# EAGLE design MySXSenors-VM02-002 (EAGLE 7.7.0)
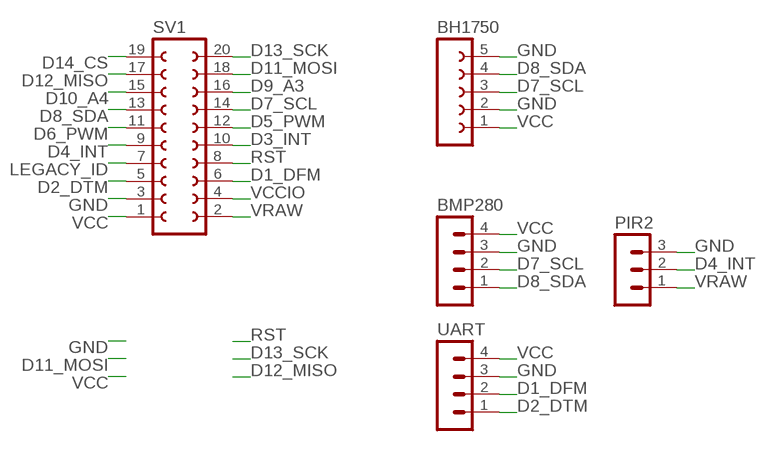
[diagram p0: schematic, sheet 1]

## Parts
BH1750  FE05-1  [FE05-1]
BMP280  MA04-1  [MA04-1]
PIR2  MA03-1  [MA03-1]
SV1  FE10-2  [FE10-2]
UART  MA04-1  [MA04-1]

## Nets
D1_DFM: SV1.6 UART.2
D2_DTM: SV1.5 UART.1
D3_INT: SV1.10
D4_INT: PIR2.2 SV1.9
D5_PWM: SV1.12
D6_PWM: SV1.11
D7_SCL: BH1750.3 BMP280.2 SV1.14
D8_SDA: BH1750.4 BMP280.1 SV1.13
D9_A3: SV1.16
D10_A4: SV1.15
D11_MOSI: SV1.18
D12_MISO: SV1.17
D13_SCK: SV1.20
D14_CS: SV1.19
GND [power]: BH1750.2 BH1750.5 BMP280.3 PIR2.3 SV1.3 UART.3
LEGACY_ID: SV1.7
RST: SV1.8
VCC [power]: BH1750.1 BMP280.4 SV1.1 UART.4
VCCIO [power]: SV1.4
VRAW [power]: PIR2.1 SV1.2

## Library data of the parts
BH1750 = con-lsta:FE05-1: FEMALE HEADER; OC_FARNELL: unknown; OC_NEWARK: unknown
BMP280 UART = con-lstb:MA04-1: PIN HEADER; OC_FARNELL: unknown; OC_NEWARK: unknown
PIR2 = con-lstb:MA03-1: PIN HEADER; OC_FARNELL: unknown; OC_NEWARK: unknown
SV1 = my-con-lsta:FE10-2: FEMALE HEADER; OC_FARNELL: unknown; OC_NEWARK: unknown

## Net classes
0 default: width 0.203 mm
1 power: width 0.508 mm

## Board
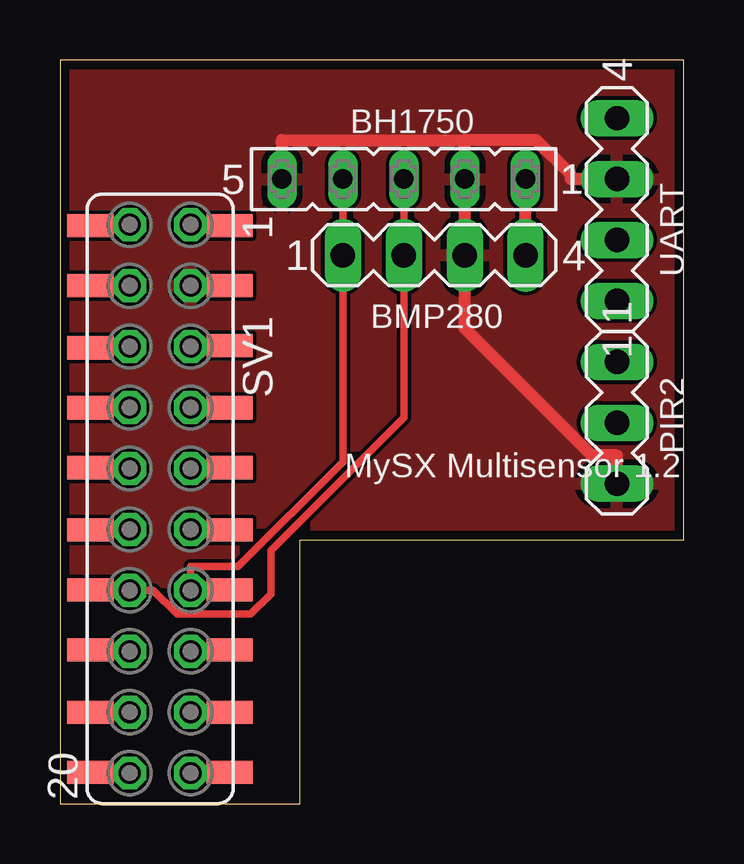
[diagram p1: board, top side]
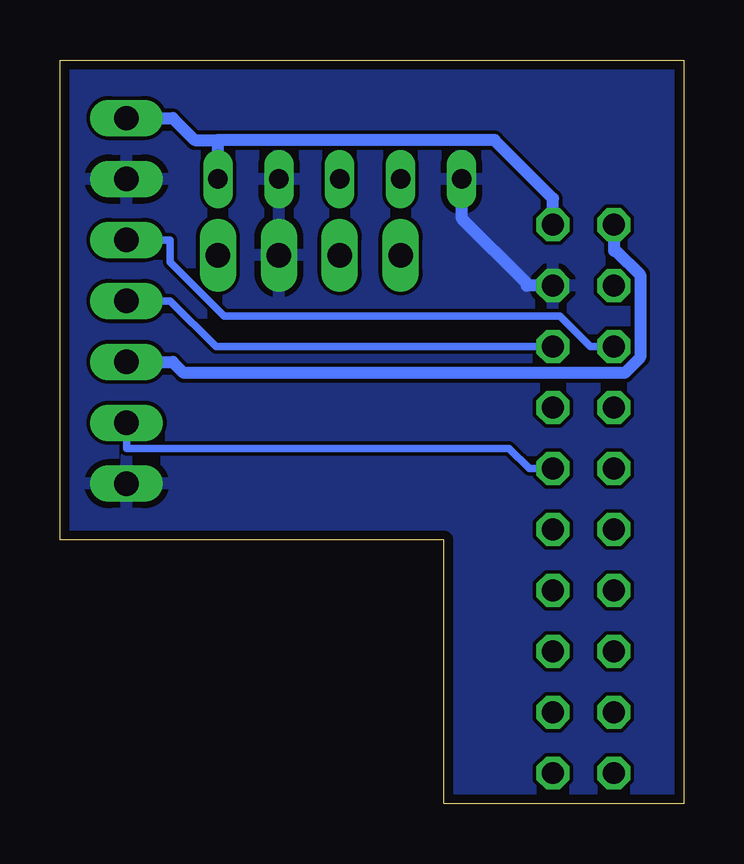
[diagram p2: board, bottom side, seen from below]

Size 26 x 31 mm. Coordinates in mm from the lower left corner, seen from the top.
Outline: 0,0 10,0 10,11 26,11 26,31 0,31 0,0
Copper layers (1*16): Top 0.0356mm / dielectric 1.5011mm / Bottom 0.0356mm
Design rules "PCBs_io": minimum track width 6mil, minimum drill 13mil, track to track 6mil, track to pad 6mil, pad to pad 6mil, via to via 6mil, smd to smd 6mil, copper to edge 15mil, drill to drill 6mil, minimum pad ring 7mil, minimum via ring 7mil, stop-mask expansion 3mil, vias tented up to drill 0mil, thermal gap 10mil

### Footprints (pad centres in the part's own frame; a part is rotated, then mirrored left to right if it is on the bottom)
FE05-1 = drill 0.813 long: 1 -5.08,0; 2 -2.54,0; 3 0,0; 4 2.54,0; 5 5.08,0
MA04-1 = drill 1.016 long: 1 -3.81,0; 2 -1.27,0; 3 1.27,0; 4 3.81,0
MA03-1 = drill 1.016 long: 1 -2.54,0; 2 0,0; 3 2.54,0
FE10-2 = drill 0.914 octagon: 1 -11.43,1.27; 2 -11.43,-1.27; 3 -8.89,1.27; 4 -8.89,-1.27; 5 -6.35,1.27; 6 -6.35,-1.27; 7 -3.81,1.27; 8 -3.81,-1.27; 9 -1.27,1.27; 10 -1.27,-1.27; 11 1.27,1.27; 12 1.27,-1.27; 13 3.81,1.27; 14 3.81,-1.27; 15 6.35,1.27; 16 6.35,-1.27; 17 8.89,1.27; 18 8.89,-1.27; 19 11.43,1.27; 20 11.43,-1.27 | smd 0.965 x 1.93: P$1 -8.9,2.9; P$2 -11.4,2.9; P$3 -11.4,-2.9; P$4 -8.9,-2.9; P$5 -6.4,2.9; P$6 -3.8,2.9; P$7 -1.3,2.9; P$8 1.3,2.9; P$9 3.8,2.9; P$10 6.3,2.9; P$11 8.9,2.9; P$12 11.4,2.9; P$13 -6.3,-2.9; P$14 -3.8,-2.9; P$15 -1.3,-2.9; P$16 1.3,-2.9; P$17 3.8,-2.9; P$18 6.3,-2.9; P$19 8.9,-2.9; P$20 11.4,-2.9

### Placement (x,y rotation side)
BH1750  14.34,26.04 180 top
BMP280  15.61,22.86 0 top
PIR2  23.23,15.88 270 top
SV1  4.17,12.7 270 top
UART  23.23,24.77 90 top

### Tracks (layer width: path | path; a pad name or v marks a point on that pad's centre or on a via)
D1_DFM
  Bottom 0.305: SV1.6 3.9,19.05 5.17,20.32 19.15,20.32 21.4,22.57 21.4,23.5 UART.2
D2_DTM
  Bottom 0.305: UART.1 21.4,20.95 19.49,19.05 SV1.5
D4_INT
  Bottom 0.305: SV1.9 6.44,13.97 7.27,14.81 23.23,14.81 PIR2.2
D7_SCL
  Top 0.305: SV1.14 3.9,8.89 4.89,7.9 7.96,7.9 8.8,8.75 8.8,10.56 14.34,16.09 BMP280.2 BH1750.3
D8_SDA
  Top 0.305: SV1.13 5.45,9.88 7.44,9.88 11.79,14.24 BMP280.1 BH1750.4
GND
  Top 0.508: PIR2.3 23.23,14.5 22.18,14.5 16.88,19.8 BMP280.3 BH1750.2 16.88,27.66 | BH1750.5 9.26,27.66 16.88,27.66 | UART.3 21.3,26.04 21.3,26.21 19.84,27.66 16.88,27.66
  Bottom 0.508: SV1.3 6.54,21.59 6.54,21.69 9.26,24.41 BH1750.5
  pour Bottom: -0.02,0 9.76,0 9.76,11.21 26.4,11.21 26.4,30.56 -0.02,30.56
  pour Top: -0.02,0 9.76,0 9.76,11.21 26.4,11.21 26.4,30.56 -0.02,30.56
VCC
  Top 0.508: BMP280.4 BH1750.1
  Bottom 0.508: SV1.1 5.45,25.22 7.88,27.66 19.41,27.66 | BH1750.1 19.41,27.66 | UART.4 21.3,28.57 20.38,27.66 19.41,27.66
VRAW
  Bottom 0.508: PIR2.1 21.3,18.41 20.84,17.96 2.45,17.96 1.81,18.6 1.81,22.05 2.8,23.04 2.91,23.04 SV1.2

### Text on the board
tNames: MySX Multisensor 1.2